# EAGLE design main1 (EAGLE 7.5.0)
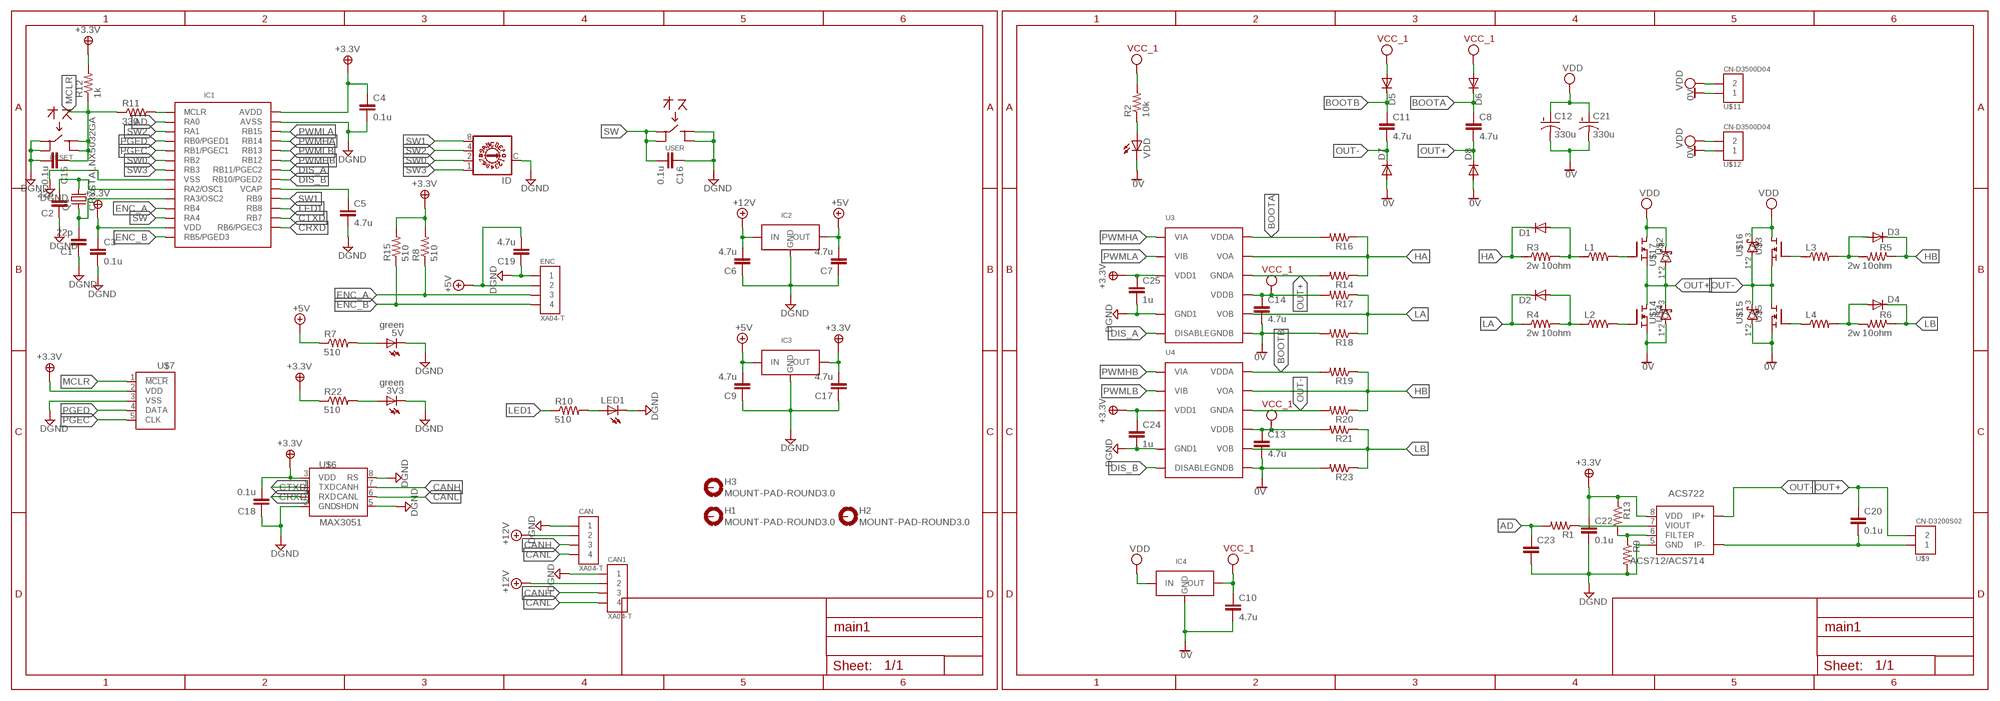
[diagram p0: schematic, sheet 1]

## Parts
3V3  green  LEDCHIPLED_0603  [CHIPLED_0603]
5V  green  LEDCHIPLED_0603  [CHIPLED_0603]
ACS722  ACS712/ACS714  [SOIC8]
C1  22p  C-EUC0603K  [C0603K]
C2  22p  C-EUC0603K  [C0603K]
C3  0.1u  C-EUC0603K  [C0603K]
C4  0.1u  C-EUC0603K  [C0603K]
C5  4.7u  C-EUC0805K  [C0805K]
C6  4.7u  C-EUC0805K  [C0805K]
C7  4.7u  C-EUC0805K  [C0805K]
C8  4.7u  C-EUC0805K  [C0805K]
C9  4.7u  C-EUC0805K  [C0805K]
C10  4.7u  C-EUC0805K  [C0805K]
C11  4.7u  C-EUC0805K  [C0805K]
C12  330u  CPOL-USG  [PANASONIC_G]
C13  4.7u  C-EUC0805K  [C0805K]
C14  4.7u  C-EUC0805K  [C0805K]
C15  0.1u  C-EUC0603K  [C0603K]
C16  0.1u  C-EUC0603K  [C0603K]
C17  4.7u  C-EUC0805K  [C0805K]
C18  0.1u  C-EUC0603K  [C0603K]
C19  4.7u  C-EUC0805K  [C0805K]
C20  0.1u  C-EUC0603K  [C0603K]
C21  330u  CPOL-USG  [PANASONIC_G]
C22  0.1u  C-EUC1206  [C1206]
C23  C-EUC0603K  [C0603K]
C24  1u  C-EUC0603K  [C0603K]
C25  1u  C-EUC0603K  [C0603K]
CAN  XA04-T  [XA04]
CAN1  XA04-T  [XA04]
D1  DIODE-SOD123  [SOD123]
D2  DIODE-SOD123  [SOD123]
D3  DIODE-SOD123  [SOD123]
D4  DIODE-SOD123  [SOD123]
D5  DIODE-SOD123  [SOD123]
D6  DIODE-SOD123  [SOD123]
D7  DIODE-SOD123  [SOD123]
D8  DIODE-SOD123  [SOD123]
ENC  XA04-T  [XA04]
H1  MOUNT-PAD-ROUND3.0  [3,0-PAD]
H2  MOUNT-PAD-ROUND3.0  [3,0-PAD]
H3  MOUNT-PAD-ROUND3.0  [3,0-PAD]
IC1  DSPIC33FJ128MC802  [SOIC28]
IC2  REGULATER_MIC39100-5.0WS  REGULATER_MIC39100-3.3WS  [SOT-223]
IC3  REGULATER_AZ1117CR  [SOT89]
IC4  REGULATER_MIC2940A-5.0WU  [TO-263-3]
ID  A1353HEX  [A1353HEX]
L1  R-US_R0805  [R0805]
L2  R-US_R0805  [R0805]
L3  R-US_R0805  [R0805]
L4  R-US_R0805  [R0805]
LED1  LEDCHIPLED_0603  [CHIPLED_0603]
Q1  CRYSTALNX5032GA  [NX5032GA]
R1  R-US_R0603  [R0603]
R2  10k  R-US_R0603  [R0603]
R3  2w 10ohm  R-US_R2512  [R2512]
R4  2w 10ohm  R-US_R2512  [R2512]
R5  2w 10ohm  R-US_R2512  [R2512]
R6  2w 10ohm  R-US_R2512  [R2512]
R7  510  R-US_R0603  [R0603]
R8  510  R-US_R0603  [R0603]
R9  R-US_R0603  [R0603]
R10  510  R-US_R0603  [R0603]
R11  330  R-US_R0603  [R0603]
R12  1k  R-US_R0603  [R0603]
R13  R-US_R0603  [R0603]
R14  R-US_R0603  [R0603]
R15  510  R-US_R0603  [R0603]
R16  R-US_R0603  [R0603]
R17  R-US_R0603  [R0603]
R18  R-US_R0603  [R0603]
R19  R-US_R0603  [R0603]
R20  R-US_R0603  [R0603]
R21  R-US_R0603  [R0603]
R22  510  R-US_R0603  [R0603]
R23  R-US_R0603  [R0603]
RESET  SWITCH_4PALPS  [SKRP]
U3  ADUM3223_SMD  [SOIC16_N]
U4  ADUM3223_SMD  [SOIC16_N]
U$1  CN-D3500D04  [D-3500D04]
U$2  FET_NCH_FDMS86152  [PQFN_8L]
U$3  FET_NCH_FDMS86152  [PQFN_8L]
U$4  FET_NCH_FDMS86152  [PQFN_8L]
U$5  FET_NCH_FDMS86152  [PQFN_8L]
U$6  MAX3051  [SOIC8]
U$7  WRITE_FOR_PICT  [ZH05]
U$9  CN-D3200S02  [D-3200S02-S]
U$14  SCHOTTKY_BARRIER_DIODE_FSV560  [TO-277]
U$15  SCHOTTKY_BARRIER_DIODE_FSV560  [TO-277]
U$16  SCHOTTKY_BARRIER_DIODE_FSV560  [TO-277]
U$17  SCHOTTKY_BARRIER_DIODE_FSV560  [TO-277]
USER  SWITCH_4PALPS  [SKRP]
VDD  LEDCHIPLED_0603  [CHIPLED_0603]

## Nets
0V: C10.2 C12.- C13.2 C14.2 C21.- D7.A D8.A IC4.2(GND) IC4.PAD(GND) R18.2 R23.2 U3.P$9(GNDB) U4.P$9(GNDB) U$1.01A U$1.02A U$4.1(S) U$4.2(S) U$4.3(S) U$5.1(S) U$5.2(S) U$5.3(S) U$14.1(A) U$14.2(A) U$15.1(A) U$15.2(A) VDD.C
3.3V: ACS722.8(VDD) C3.1 C4.1 C17.2 C18.2 C22.1 C24.1 C25.1 IC1.13(VDD) IC1.28(AVDD) IC3.2(OUT) IC3.P(OUT) R8.2 R12.2 R13.1 R15.2 R22.1 U3.P$3(VDD1) U3.P$8(VDD1) U4.P$3(VDD1) U4.P$8(VDD1) U$6.3(VDD) U$7.2(VDD) ; supply symbol labelled +3.3V
+5V: C7.2 C9.2 C19.2 ENC.PIN2 IC2.3(OUT) IC3.3(IN) R7.1
+12V: C6.2 CAN1.PIN2 CAN.PIN2 IC2.1(IN)
AD: C23.1 IC1.2(RA0) R1.2
BOOTA: C8.1 D6.C R16.2 U3.P$16(VDDA)
BOOTB: C11.1 D5.C R19.2 U4.P$16(VDDA)
CANH: CAN1.PIN3 CAN.PIN3 U$6.7(CANH)
CANL: CAN1.PIN4 CAN.PIN4 U$6.6(CANL)
CRXD: IC1.15(RB6/PGEC3) U$6.4(RXD)
CTXD: IC1.16(RB7) U$6.1(TXD)
DGND: 3V3.C 5V.C ACS722.5(GND) C1.1 C2.1 C3.2 C4.2 C5.2 C6.1 C7.1 C9.1 C15.2 C16.1 C17.1 C18.1 C19.1 C22.2 C23.2 C24.2 C25.2 CAN1.PIN1 CAN.PIN1 ENC.PIN1 IC1.8(VSS) IC1.19(VSS) IC1.27(AVSS) IC2.2(GND) IC2.TAB(GND) IC3.1(GND) ID.C LED1.C R9.2 RESET.1 RESET.2 U3.P$4(GND1) U4.P$4(GND1) U$6.2(GND) U$6.5(SHDN) U$6.8(RS) U$7.3(VSS) USER.3 USER.4
DIS_A: IC1.22(RB11/PGEC2) U3.P$5(DISABLE)
DIS_B: IC1.21(RB10/PGED2) U4.P$5(DISABLE)
ENC_A: ENC.PIN3 IC1.11(RB4) R8.1
ENC_B: ENC.PIN4 IC1.14(RB5/PGED3) R15.1
HA: D1.C R3.1 R14.1 R16.1 U3.P$15(VOA)
HB: D3.C R5.1 R19.1 R20.1 U4.P$15(VOA)
LA: D2.C R4.1 R17.1 R18.1 U3.P$10(VOB)
LB: D4.C R6.1 R21.1 R23.1 U4.P$10(VOB)
LED1: IC1.17(RB8) R10.1
MCLR: C15.1 R11.1 R12.1 RESET.3 RESET.4 U$7.1(!MCLR)
N$1: C2.2 IC1.9(RA2/OSC1) Q1.2
N$2: C1.2 IC1.10(RA3/OSC2) Q1.1
N$3: C5.1 IC1.20(VCAP)
N$4: L2.2 U$4.4(G)
N$5: R2.1 VDD.A
N$6: ACS722.7(VIOUT) R1.1
N$7: LED1.A R10.2
N$8: D1.A L1.1 R3.2
N$9: D2.A L2.1 R4.2
N$10: 5V.A R7.2
N$12: L4.1 U$5.4(G)
N$13: D4.A L4.2 R6.2
N$14: L3.1 U$3.4(G)
N$15: D3.A L3.2 R5.2
N$16: ACS722.3(IP-) ACS722.4(IP-) C20.2 U$9.1 U$9.P$1
N$17: IC1.1(MCLR) R11.2
N$18: ACS722.6(FILTER) R9.1 R13.2
N$22: 3V3.A R22.2
N$23: L1.2 U$2.4(G)
OUT+: C8.2 C20.1 D8.C R14.2 U3.P$14(GNDA) U$2.1(S) U$2.2(S) U$2.3(S) U$4.5(D) U$4.6(D) U$4.7(D) U$4.8(D) U$4.PAD(D) U$9.2 U$9.P$2 U$14.3(C) U$17.1(A) U$17.2(A)
OUT-: ACS722.1(IP+) ACS722.2(IP+) C11.2 D7.C R20.2 U4.P$14(GNDA) U$3.1(S) U$3.2(S) U$3.3(S) U$5.5(D) U$5.6(D) U$5.7(D) U$5.8(D) U$5.PAD(D) U$15.3(C) U$16.1(A) U$16.2(A)
PGEC: IC1.5(RB1/PGEC1) U$7.5(CLK)
PGED: IC1.4(RB0/PGED1) U$7.4(DATA)
PWMHA: IC1.25(RB14) U3.P$1(VIA)
PWMHB: IC1.23(RB12) U4.P$1(VIA)
PWMLA: IC1.26(RB15) U3.P$2(VIB)
PWMLB: IC1.24(RB13) U4.P$2(VIB)
SW: C16.2 IC1.12(RA4) USER.1 USER.2
SW0: IC1.6(RB2) ID.2
SW1: IC1.18(RB9) ID.8
SW2: IC1.3(RA1) ID.4
SW3: IC1.7(RB3) ID.1
VCC_1: C10.1 C13.1 C14.1 D5.A D6.A IC4.3(OUT) R2.2 R17.2 R21.2 U3.P$11(VDDB) U4.P$11(VDDB)
VDD: C12.+ C21.+ IC4.1(IN) U$1.01B U$1.02B U$2.5(D) U$2.6(D) U$2.7(D) U$2.8(D) U$2.PAD(D) U$3.5(D) U$3.6(D) U$3.7(D) U$3.8(D) U$3.PAD(D) U$16.3(C) U$17.3(C)
Unconnected: H1.B3,0(MOUNT) H2.B3,0(MOUNT) H3.B3,0(MOUNT)

## Library data of the parts
3V3 5V LED1 VDD = led:LED: LED OSRAM: - CHIPLED LG R971, LG N971, LY N971, LG Q971, LY Q971, LO R971, LY R971 LH N974, LH R974 LS Q976, LO Q976, LY Q976 LO Q996 - Hyper CHIPLED LW Q18S LB Q993, LB Q99A, LB R99A - SideLED LS A670, LO A670, LY A670, LG A670, LP A670 LB A673, LV A673, LT A673, LW A673 LH A674 LY A675 LS A676, LA A676, LO A676, LY A676, LW A676 LS A679, LY A679, LG A679 - Hyper Micro SIDELED® LS Y876, LA Y876, LO Y876, LY Y876 LT Y87S - SmartLED LW L88C, LW L88S LB L89C, LB L89S, LG L890 LS L89K, LO L89K, LY L89K LS L896, LA L896, LO L896, LY L896 - TOPLED LS T670, LO T670, LY T670, LG T670, LP T670 LSG T670, LSP T670, LSY T670, LOP T670, LYG T670 LG T671, LOG T671, LSG T671 LB T673, LV T673, LT T673, LW T673 LH T674 LS T676, LA T676, LO T676, LY T676, LB T676, LH T676, LSB T676, LW T676 LB T67C, LV T67C, LT T67C, LS T67K, LO T67K, LY T67K, LW E67C LS E67B, LA E67B, LO E67B, LY E67B, LB E67C, LV E67C, LT E67C LW T67C LS T679, LY T679, LG T679 LS T770, LO T770, LY T770, LG T770, LP T770 LB T773, LV T773, LT T773, LW T773 LH T774 LS E675, LA E675, LY E675, LS T675 LS T776, LA T776, LO T776, LY T776, LB T776 LHGB T686 LT T68C, LB T68C - Hyper Mini TOPLED® LB M676 - Mini TOPLED Santana® LG M470 LS M47K, LO M47K, LY M47K Source: http://www.osram.convergy.de LUXEON: - LUMILED® LXK2-PW12-R00, LXK2-PW12-S00, LXK2-PW14-U00, LXK2-PW14-V00 LXK2-PM12-R00, LXK2-PM12-S00, LXK2-PM14-U00 LXK2-PE12-Q00, LXK2-PE12-R00, LXK2-PE12-S00, LXK2-PE14-T00, LXK2-PE14-U00 LXK2-PB12-K00, LXK2-PB12-L00, LXK2-PB12-M00, LXK2-PB14-N00, LXK2-PB14-P00, LXK2-PB14-Q00 LXK2-PR12-L00, LXK2-PR12-M00, LXK2-PR14-Q00, LXK2-PR14-R00 LXK2-PD12-Q00, LXK2-PD12-R00, LXK2-PD12-S00 LXK2-PH12-R00, LXK2-PH12-S00 LXK2-PL12-P00, LXK2-PL12-Q00, LXK2-PL12-R00 Source: www.luxeon.com KINGBRIGHT: KA-3528ASYC Source: www.kingbright.com
ACS722 = Shohei:ACS712/ACS714
C1-C11 C13-C20 C22-C25 = rp_c:C-EU: CAPACITOR, European symbol
C12 C21 = rcl:CPOL-US: POLARIZED CAPACITOR, American symbol
CAN CAN1 ENC = rp_cn_xa:XA04
D1-D8 = diode:DIODE-: DIODE
H1-H3 = Shohei:MOUNT-PAD-ROUND: MOUNTING PAD, round
IC1 = Syohei:DSPIC33FJ128MC802
IC2-IC4 = Shohei:REGULATER
ID = switch-dil:A1353HEX: DIL/CODE SWITCH; OC_FARNELL: unknown; OC_NEWARK: unknown
L1-L4 R1-R23 = rp_r:R-US_: RESISTOR, American symbol
Q1 = Shohei:CRYSTAL
RESET USER = Syohei:SWITCH_4P
U3 U4 = Shohei:ADUM3223
U$1 = Syohei:CN-D3500D04
U$2-U$5 = Shohei:FET_NCH
U$6 = Syohei:MAX3051
U$7 = Syohei:WRITE_FOR_PIC
U$9 = Syohei:CN-D3200S02
U$14-U$17 = Shohei:SCHOTTKY_BARRIER_DIODE

## Board
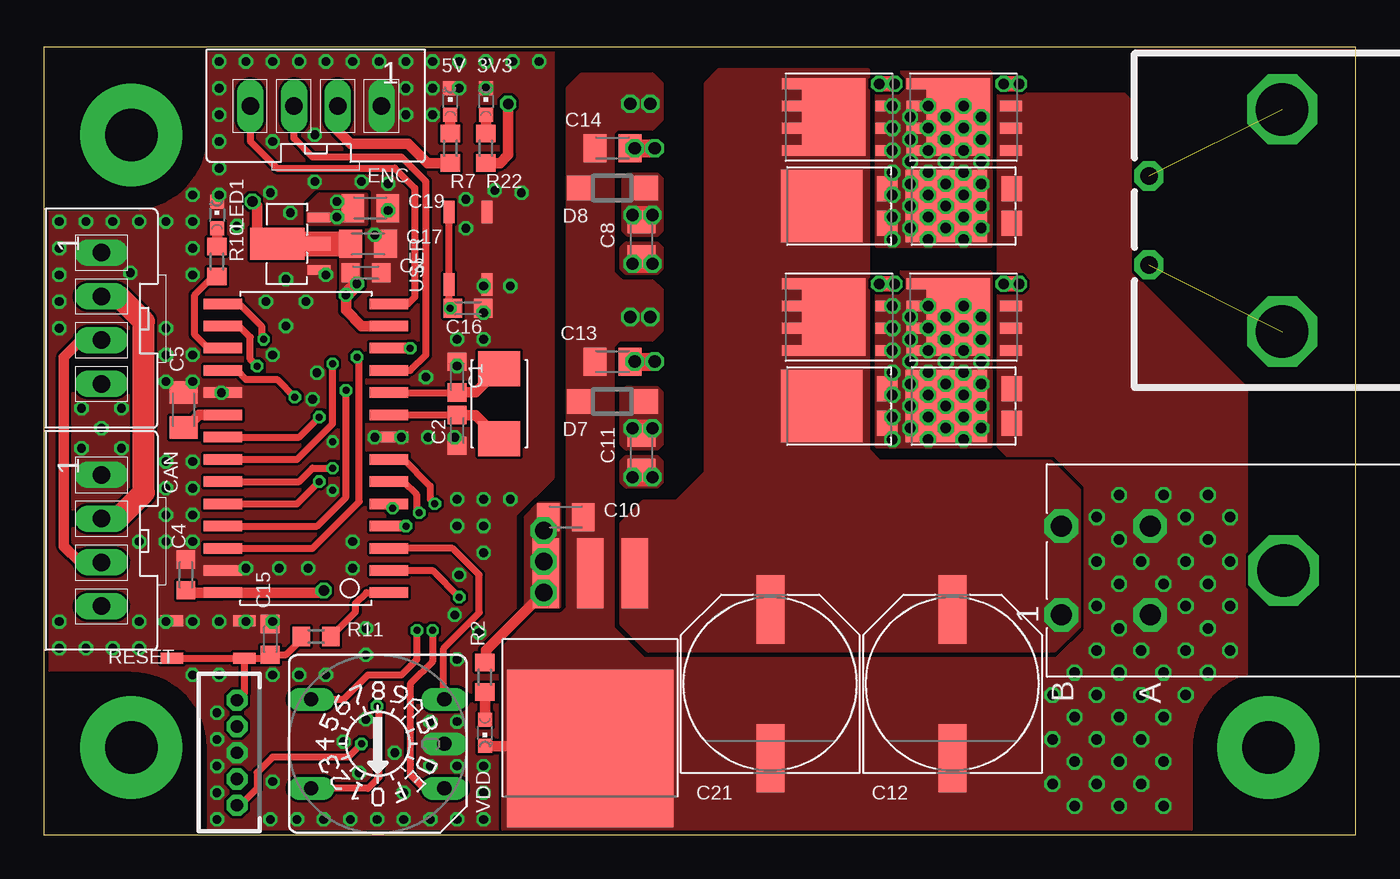
[diagram p1: board, top side]
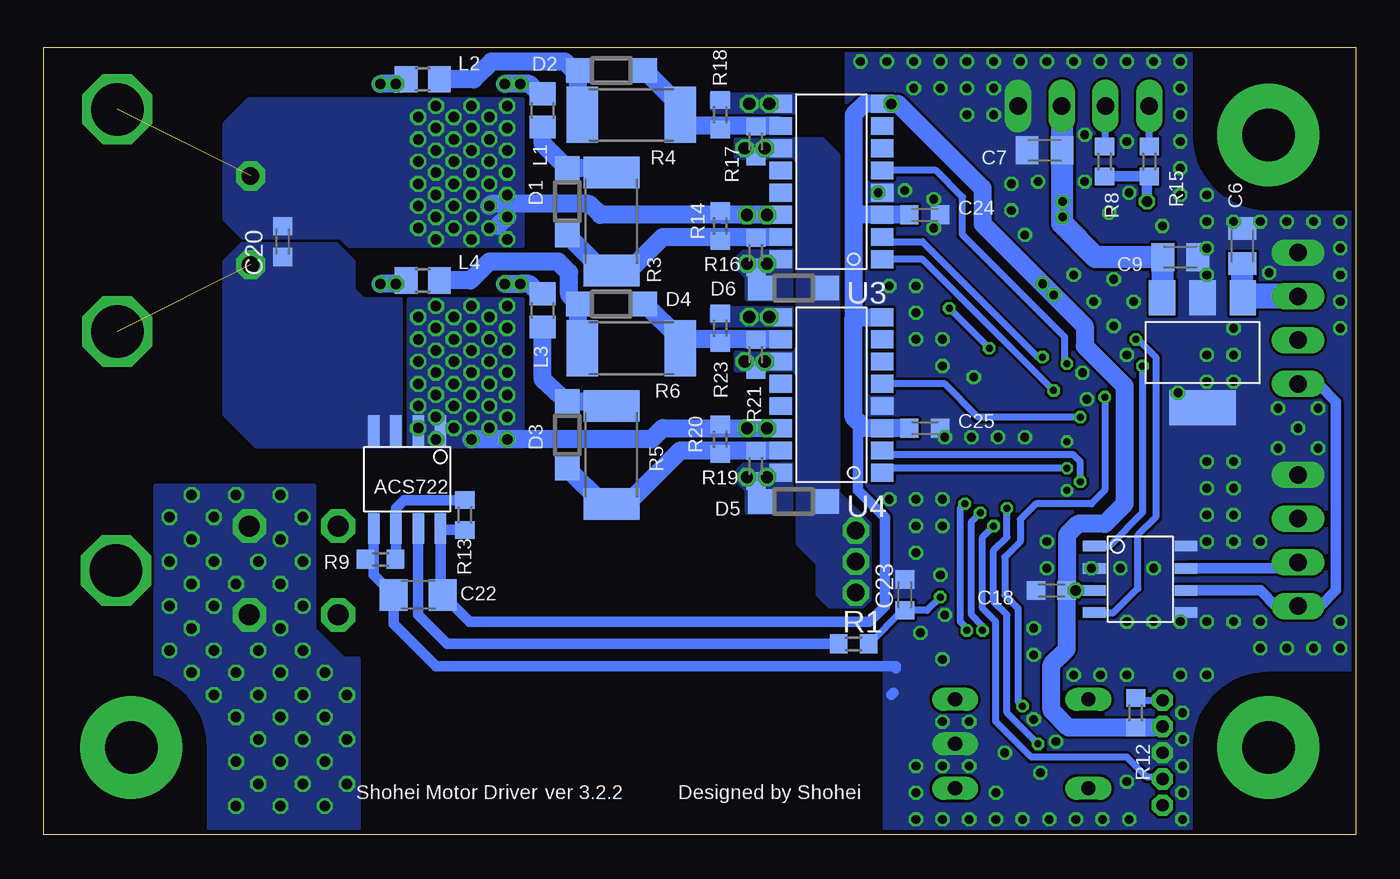
[diagram p2: board, bottom side, seen from below]

Size 75 x 45 mm. Coordinates in mm from the lower left corner, seen from the top.
Outline: 0,0 75,0 75,45 0,45 0,0
Copper layers (1*16): Top 0.035mm / dielectric 1.5mm / Bottom 0.035mm
Design rules "Elecrow_2-layer_eagle_rule": minimum track width 6mil, minimum drill 12mil, track to track 6mil, track to pad 6mil, pad to pad 6mil, via to via 6mil, smd to smd 0mil, copper to edge 10mil, drill to drill 10mil, minimum pad ring 10mil, minimum via ring 6mil, stop-mask expansion 2mil, vias tented up to drill 100mil, thermal gap 10mil
tRestrict: 5 lines

### Footprints (pad centres in the part's own frame; a part is rotated, then mirrored left to right if it is on the bottom)
CHIPLED_0603 = smd 0.8 x 0.8: A 0,-0.75; C 0,0.75
SOIC8 = smd 0.65 x 1.75: 1 -1.905,-2.8; 2 -0.635,-2.8; 3 0.635,-2.8; 4 1.905,-2.8; 5 1.905,2.8; 6 0.635,2.8; 7 -0.635,2.8; 8 -1.905,2.8
C0603K = smd 1.05 x 1.08: 1 -0.875,0; 2 0.875,0
C0805K = smd 1.3 x 1.6: 1 -1,0; 2 1,0
PANASONIC_G = smd 3.9 x 1.6: + 4.25,0; - -4.25,0
C1206 = smd 1.6 x 1.8: 1 -1.4,0; 2 1.4,0
XA04 = drill 1 long: PIN1 0,0; PIN2 -2.5,0; PIN3 -5,0; PIN4 -7.5,0
SOD123 = smd 1.4 x 1.4: A 1.9,0; C -1.9,0
3,0-PAD = drill 3 pad 5.842: B3,0 0,0
SOIC28 = smd 0.6 x 2.2: 1 -8.255,-4.75; 2 -6.985,-4.75; 3 -5.715,-4.75; 4 -4.445,-4.75; 5 -3.175,-4.75; 6 -1.905,-4.75; 7 -0.635,-4.75; 8 0.635,-4.75; 9 1.905,-4.75; 10 3.175,-4.75; 11 4.445,-4.75; 12 5.715,-4.75; 13 6.985,-4.75; 14 8.255,-4.75; 15 8.255,4.75; 16 6.985,4.75; 17 5.715,4.75; 18 4.445,4.75; 19 3.175,4.75; 20 1.905,4.75; 21 0.635,4.75; 22 -0.635,4.75; 23 -1.905,4.75; 24 -3.175,4.75; 25 -4.445,4.75; 26 -5.715,4.75; 27 -6.985,4.75; 28 -8.255,4.75
SOT-223 = smd 1.499 x 2.007: 1 -2.311,-3.15; 2 0,-3.15; 3 2.311,-3.15 | smd 3.81 x 2.007: TAB 0,3.15
SOT89 = smd 0.55 x 1.3: 1 -1.5,0; 3 1.5,0 | smd 0.8 x 1.475: 2 0,0.087 | smd 1.85 x 3.125: P 0,2.388
TO-263-3 = smd 1.5 x 4: 1 -2.54,0; 2 0,0; 3 2.54,0 | smd 9.5 x 9: PAD 0,10
A1353HEX = drill 0.813 long: 1 3.81,-2.54; 2 -3.81,2.54; 4 3.81,2.54; 8 -3.81,-2.54; C 3.81,0
R0805 = smd 1.3 x 1.5: 1 -0.95,0; 2 0.95,0
NX5032GA = smd 2 x 2.4: 1 -2,0; 2 2,0
R0603 = smd 1 x 1.1: 1 -0.85,0; 2 0.85,0
R2512 = smd 1.8 x 3.2: 1 -2.8,0; 2 2.8,0
SKRP = smd 1.27 x 0.635: 1 -2.075,1.075; 2 2.075,1.075; 3 -2.075,-1.075; 4 2.075,-1.075
SOIC16_N = smd 1.016 x 1.27: P$1 -4.445,-2.9; P$2 -3.175,-2.9; P$3 -1.905,-2.9; P$4 -0.635,-2.9; P$5 0.635,-2.9; P$6 1.905,-2.9; P$7 3.175,-2.9; P$8 4.445,-2.9; P$9 4.445,2.9; P$10 3.175,2.9; P$11 1.905,2.9; P$12 0.635,2.9; P$13 -0.635,2.9; P$14 -1.905,2.9; P$15 -3.175,2.9; P$16 -4.445,2.9
D-3500D04 = drill 1.2 pad 1.93 octagon: 01A -2.54,-5.08; 01B -2.54,0; 02A 2.54,-5.08; 02B 2.54,0 | drill 3 pad 4 octagon: P$1 0,-12.7
PQFN_8L = smd 0.61 x 1.27: 1 -1.905,-2.703; 2 -0.635,-2.703; 3 0.635,-2.703; 4 1.905,-2.703 | smd 0.61 x 1.14: 5 1.905,2.703; 6 0.635,2.703; 7 -0.635,2.703; 8 -1.905,2.703 | smd 4.42 x 3.65: PAD 0,0.307
SOIC8' = smd 0.6 x 1.3: 1 -1.905,-2.625; 2 -0.635,-2.625; 3 0.635,-2.625; 4 1.905,-2.625; 5 1.905,2.625; 6 0.635,2.625; 7 -0.635,2.625; 8 -1.905,2.625
ZH05 = drill 0.7 octagon: 1 3,0; 2 1.5,0; 3 0,0; 4 -1.5,0; 5 -3,0
D-3200S02-S = drill 1 pad 1.676 octagon: 1 -2.6,21.28; 2 2.48,21.28 | drill 3 pad 4 octagon: P$1 -6.41,13.66; P$2 6.29,13.66
TO-277 = smd 1.15 x 1.45: 1 2.75,0.985; 2 2.75,-0.985 | smd 4.65 x 4.15: 3 -1,0

### Placement (x,y rotation side)
3V3  25.27,41.91 0 top
5V  23.24,41.91 0 top
ACS722  54.23,20.32 180 bottom
C1  23.62,26.16 270 top
C2  23.62,23.11 90 top
C3  18.41,32.13 0 top
C4  8.13,14.86 90 top
C5  8,24.29 90 top
C6  6.48,33.66 270 bottom
C7  17.78,39.12 0 bottom
C8  34.16,34.04 90 top
C9  10.03,33.02 180 bottom
C10  29.84,18.16 0 top
C11  34.16,21.84 90 top
C12  51.94,8.64 90 top
C13  32.51,27.05 180 top
C14  32.51,39.24 180 top
C15  12.95,11.18 90 top
C16  24.26,30.1 180 top
C17  18.54,33.78 180 top
C18  17.4,13.97 0 bottom
C19  18.67,35.81 180 top
C20  61.34,33.91 270 bottom
C21  41.53,8.64 90 top
C22  53.59,13.72 180 bottom
C23  25.78,13.72 90 bottom
C24  24.64,35.43 0 bottom
C25  24.64,23.24 0 bottom
CAN  3.3,20.57 90 top
CAN1  3.3,33.27 90 top
D1  45.09,36.2 90 bottom
D2  42.55,43.69 180 bottom
D3  45.09,22.86 90 bottom
D4  42.55,30.35 180 bottom
D5  32.13,19.05 0 bottom
D6  32.13,31.24 0 bottom
D7  32.51,24.77 180 top
D8  32.51,36.96 180 top
ENC  19.3,41.66 0 top
H1  5,40 0 top
H2  5,5 0 top
H3  70,5 0 top
IC1  14.99,22.1 90 top
IC2  8.76,27.56 180 bottom
IC3  15.75,33.78 90 top
IC4  31.24,14.95 180 top
ID  19.1,5.21 0 top
L1  46.48,41.4 90 bottom
L2  53.34,43.18 180 bottom
L3  46.48,29.97 270 bottom
L4  53.34,31.69 0 bottom
LED1  9.91,35.43 0 top
Q1  26.04,24.64 270 top
R1  28.7,10.92 0 bottom
R2  25.22,9.02 90 top
R3  42.55,35.05 90 bottom
R4  41.4,41.15 180 bottom
R5  42.55,21.72 90 bottom
R6  41.4,27.81 180 bottom
R7  23.24,39.24 90 top
R8  14.35,38.48 270 bottom
R9  55.75,15.75 180 bottom
R10  9.91,32.77 90 top
R11  15.57,11.34 0 top
R12  12.57,6.99 270 bottom
R13  50.93,18.29 90 bottom
R14  36.32,34.8 90 bottom
R15  11.8,38.48 270 bottom
R16  34.29,33.27 270 bottom
R17  34.29,39.62 270 bottom
R18  36.32,41.15 90 bottom
R19  34.29,21.08 270 bottom
R20  36.32,22.61 90 bottom
R21  34.29,27.43 270 bottom
R22  25.27,39.24 90 top
R23  36.32,28.96 90 bottom
RESET  9.4,11.18 0 top
U3  29.97,37.34 90 bottom
U4  29.97,25.15 90 bottom
U$1  58.17,15.11 90 top
U$2  45.47,41.02 90 top
U$3  45.47,29.59 90 top
U$4  52.58,41.02 90 top
U$5  52.58,29.59 90 top
U$6  MAX3051  [SOIC8']  12.32,14.61 270 bottom
U$7  11.05,4.7 90 top
U$9  84.45,35.18 90 top
U$14  52.58,35.94 0 top
U$15  52.58,24.51 0 top
U$16  45.47,24.51 0 top
U$17  45.47,35.94 0 top
USER  24.26,33.53 90 top
VDD  25.22,5.84 180 top

### Tracks (layer width: path | path; a pad name or v marks a point on that pad's centre or on a via)
0V  (via drill 0.6, 0.7)
  Top 0.61: VDD.C 25.23,5.08 27.05,5.08
  other vias: 34.67,29.59 33.53,29.59 34.67,41.78 33.53,41.78 61.47,19.43 64.01,19.43 66.55,19.43 61.47,16.89 66.55,16.89 60.2,15.62 62.74,15.62 65.28,15.62 67.82,15.62 60.2,18.16 65.28,18.16 67.82,18.16 61.47,14.35 64.01,14.35 66.55,14.35 60.2,13.08 65.28,13.08 67.82,13.08 61.47,11.81 66.55,11.81 60.2,10.54 62.74,10.54 65.28,10.54 67.82,10.54 61.47,9.27 64.01,9.27 66.55,9.27 60.2,8 62.74,8 65.28,8 61.47,6.73 64.01,6.73 57.66,5.46 60.2,5.46 62.74,5.46 58.93,4.19 61.47,4.19 64.01,4.19 57.66,2.92 60.2,2.92 62.74,2.92 58.93,1.65 61.47,1.65 64.01,1.65 57.66,8 58.93,9.27 58.93,6.73
  pour Top (rank 5, no thermals): 26.29,10.03 26.29,0 75.06,0 75.06,45.09 54.61,45.21 54.61,22.23 59.56,17.27 59.56,11.68 57.91,10.03
  pour Bottom (rank 3, no thermals): 32.13,30.1 36.83,30.1 36.83,29.34 36.58,29.08 32.13,29.08
  pour Bottom (rank 3, no thermals): 32.13,42.29 36.83,42.29 36.83,41.53 36.58,41.27 32.13,41.27
  pour Top (rank 3, no thermals): 29.97,9.4 29.97,42.67 30.73,43.43 34.8,43.43 35.31,42.93 35.31,40.89 34.8,40.39 32.77,40.39 32.51,40.13 32.51,32.13 33.02,31.62 34.8,31.62 35.31,31.11 35.31,28.83 34.8,28.32 32.89,28.32 32.51,27.94 32.51,9.4
  pour Top (rank 4, no thermals): 34.92,9.4 31.5,12.83 30.35,13.34 29.59,12.57 27.69,12.57 26.29,11.18 26.29,9.78 27.18,8.89 35.31,8.89
  pour Bottom (no thermals): 57.02,10.03 57.02,0 68.58,0 68.58,19.94 59.56,19.94 59.56,11.68 57.91,10.03
3.3V  (via drill 0.5, 0.6)
  Top 0.406: 17.54,31.13
  Top 0.61: IC1.13 18.16,29.08 17.27,29.97 v17.27,30.86 | IC3.P 12.83,33.78 12.83,33.91 12.19,34.54 12.19,35.94 v11.94,36.2 | C4.1 8.24,13.84 IC1.28 15.88,13.84 v16,13.97 | R22.1 26.07,38.39 26.54,38.86 v26.54,41.78 | 17.14,33.78 C17.2
  Top 0.8: v17.27,30.86 v17.91,31.5 17.54,31.13
  Top 1.422: IC3.P IC3.2 17.14,33.78
  Bottom 0.61: R8.2 R15.2 11.94,37.62 v11.94,36.2 | C18.2 v16,13.97 U$6.3 | 28.45,23.62 28.45,19.68 26.92,18.16 26.92,13.08 27.81,12.19 50.67,12.19 C22.1 52.32,14.1 ACS722.8 52.2,17.44 R13.1
  Bottom 0.813: 16.51,14.46 C18.2
  Bottom 1.016: C18.2 16.52,10.62 17.4,9.75 17.4,7.11 16.42,6.13 R12.2 11.11,6.13 U$7.2 | 28.7,29.59 28.7,23.88 28.45,23.62 28.07,23.24 U4.P$3 C25.1 | 28.7,29.59 U4.P$8 | 28.7,35.43 U3.P$3 C24.1 | 28.7,35.43 28.7,29.59 | 28.7,35.43 28.7,41.15 28.07,41.78 U3.P$8 v26.54,41.78 26.16,41.78 21.34,36.96 21.34,34.92 v17.27,30.86 15.49,29.08 15.49,27.94 13.21,25.65 13.21,18.92 14.35,17.78 15.88,17.78 16.51,17.14 16.51,14.46
  pour Top (no thermals): 17.02,34.16 17.02,30.99 17.4,30.61 18.03,31.24 18.03,34.29
+5V  (via drill 0.5)
  Top 0.61: R7.1 21.93,38.39 20.83,39.5 17.54,39.5 16.78,40.26 16.78,41.63 ENC.PIN2
  Bottom 0.305: v16.76,35.31 16.78,35.31
  Bottom 1.27: 11.02,30.71 IC2.3 11.03,30.75 C9.2 14.86,33.02 16.78,34.94 16.78,35.31 C7.2 | C7.2 16.78,41.63 ENC.PIN2 | 16.76,39.1 C7.2
  other vias: 16.76,36.2
  pour Top (rank 4, no thermals): 18.41,34.92 15.11,34.92 15.11,35.94 15.75,36.58 18.41,36.58
+12V
  Top 1.27: CAN.PIN2 4.23,18.07 5.71,19.56 5.71,29.35 4.29,30.77 CAN1.PIN2
  Bottom 1.27: IC2.1 6.48,30.73 C6.2
  Bottom 1.422: CAN1.PIN2 6.39,30.77 IC2.1
AD  (via drill 0.4)
  Top 0.406: IC1.2 22.23,15.11 v23.75,13.59
  Bottom 0.406: v23.75,13.59 24.51,12.83 25.65,12.83 | 25.65,12.83 25.91,12.83 27.81,10.92 R1.2 | C23.1 25.65,12.84 25.65,12.83
BOOTA  (via drill 0.7)
  Top 1.016: C8.1 v33.67,32.64 v34.8,32.64
  pour Bottom (rank 2, no thermals): 32.26,33.4 34.92,33.4 35.31,33.02 35.31,32.38 34.8,31.88 34.8,30.61 32.26,30.61
  pour Top (no thermals): 33.27,32.13 33.02,32.38 33.02,33.53 33.27,33.78 35.05,33.78 35.31,33.53 35.31,32.38 35.05,32.13
BOOTB  (via drill 0.7)
  Top 1.016: C11.1 v33.67,20.45 v34.8,20.45
  pour Bottom (rank 2, no thermals): 32.26,21.21 34.92,21.21 35.31,20.83 35.31,20.19 34.8,19.68 34.8,18.41 32.26,18.41
  pour Top (no thermals): 33.27,19.94 33.02,20.19 33.02,21.34 33.27,21.59 35.05,21.59 35.31,21.34 35.31,20.19 35.05,19.94
CANH
  Top 0.61: CAN.PIN3 2.08,15.57 1.14,16.51 1.14,27.3 2.11,28.27 CAN1.PIN3
  Bottom 0.61: CAN.PIN3 3.64,15.24 U$6.7
CANL
  Bottom 0.61: U$6.6 5.46,13.97 4.57,13.08 CAN.PIN4 2.04,13.07 1.14,13.97 1.14,24.77 2.15,25.77 CAN1.PIN4
CRXD  (via drill 0.4)
  Top 0.406: IC1.15 11.18,30.35 12.45,29.08 12.45,28.45 v12.57,28.32
  Bottom 0.406: U$6.4 13.84,12.7 12.45,14.1 12.45,17.14 11.43,18.16 11.43,27.3 12.45,28.32 v12.57,28.32
CTXD  (via drill 0.4)
  Top 0.406: v12.19,26.8 11.81,27.18 11.81,28.45 11.18,29.08 IC1.16
  Bottom 0.406: U$6.1 14.1,16.51 12.19,18.41 v12.19,26.8
DGND  (via drill 0.4, 0.5)
  Bottom 0.61: 26.54,8 26.42,8.13 | 26.29,9.53 26.29,9.65 52.58,9.65 54.99,12.07 C22.2 56.13,14.86 56.13,15.75 | 56.13,15.75 ACS722.5 | R9.2 56.13,15.75
  other vias: 0.89,35.05 2.41,35.05 0.89,33.53 0.89,32 0.89,30.48 0.89,28.96 3.94,35.05 5.46,35.05 6.99,35.05 8.51,35.05 8.51,36.58 10.03,36.58 10.03,38.1 10.03,39.62 10.03,41.15 10.03,42.67 10.03,44.2 11.56,44.2 13.08,44.2 14.61,44.2 16.13,44.2 17.65,44.2 19.18,44.2 20.7,44.2 22.23,44.2 22.23,42.67 20.7,42.67 23.75,44.2 25.27,44.2 26.8,44.2 28.32,44.2 23.75,42.67 25.27,42.67 20.7,41.15 22.23,41.15 8.51,33.53 8.51,32 6.99,28.96 6.99,27.43 8.51,27.43 6.99,25.91 8.51,25.91 6.99,21.34 8.51,21.34 6.99,19.81 8.51,19.81 8.51,18.29 6.99,18.29 6.99,16.76 8.51,16.76 5.46,16.76 5.46,12.19 5.46,10.67 3.94,10.67 2.41,10.67 0.89,10.67 0.89,12.19 6.99,12.19 8.51,12.19 10.03,12.19 11.56,12.19 13.08,12.19 8.51,9.14 10.03,9.14 9.91,0.89 9.91,2.41 9.91,3.94 9.91,5.46 9.91,6.99 13.08,9.14 14.61,9.14 16.13,9.14 13.08,3.05 12.95,0.89 14.48,0.89 16,0.89 17.53,0.89 19.05,0.89 20.57,0.89 22.1,0.89 23.62,0.89 25.15,0.89 25.15,2.41 25.15,3.94 23.62,3.94 22.1,3.94 20.57,2.41 23.62,10.03 25.15,16.13 25.15,17.65 25.15,19.18 23.62,19.18 23.62,17.65 26.67,19.18 17.65,15.24 17.65,16.76 15.11,15.24 11.56,15.24 23.62,26.8 23.62,28.32 25.15,28.32 26.67,31.37 25.15,31.37 25.15,29.84 18.92,34.29 14.99,30.48 12.7,30.48 13.08,27.43 16.13,32 12.95,36.7 13.84,29.08 15.62,26.42 15.37,24.89 10.16,25.27 16.51,22.48 16.51,19.68 13.46,15.24 17.14,5.33 18.41,6.6 18.41,10.29 18.41,11.81 23.5,12.57 23.75,14.86 24.89,11.56 23.62,6.48 22.1,6.48 20.07,4.7 18.03,3.56 4.45,22.1 4.45,24.38 2.16,24.38 2.16,22.1 3.3,23.24 4.95,32.13 24.13,34.67 24.13,36.32 25.78,36.83 27.3,36.7 21.84,26.16 19.68,37.21 19.68,35.69 18.92,22.73 20.45,22.73 21.97,22.73 23.5,22.73 13.08,39.62 15.49,40.01 13.84,31.75 14.1,35.56 15.49,37.34 18.16,37.34 11.05,34.8
  pour Bottom (rank 6, no thermals): 0,0 0,45 29.08,45 29.08,19.56 26.92,17.4 26.92,0
  pour Top (rank 6, no thermals): 0,0 0,45 29.08,45 29.08,20.45 26.92,18.29 26.92,0
DIS_A  (via drill 0.4)
  Top 0.406: IC1.22 14.48,21.46 16.51,23.5 v16.51,26.92
  Bottom 0.406: U3.P$5 24,37.97 22.48,36.45 22.48,34.29 16.64,28.45 16.64,27.05 v16.51,26.92
DIS_B  (via drill 0.4)
  Top 0.406: IC1.21 14.61,22.73 v15.75,23.88
  Bottom 0.406: v15.75,23.88 21.59,23.88 23.5,25.78 U4.P$5
ENC_A
  Top 0.406: IC1.11 20.95,26.54 21.84,27.43 21.84,37.34 20.45,38.73 15.37,38.73 14.3,39.8 ENC.PIN3
  Bottom 0.406: 14.3,39.38 ENC.PIN3
  Bottom 0.61: R8.1 14.3,39.38
ENC_B
  Top 0.406: ENC.PIN4 11.8,39.63 13.34,38.1 20.07,38.1 21.21,36.96 21.21,30.73 20.83,30.35 IC1.14
  Bottom 0.406: R15.1 ENC.PIN4
  Bottom 0.61: R15.1
HA
  Bottom 1.016: U3.P$15 34.29,34.16 | 34.29,34.16 36.32,34.16 | 36.32,34.16 39.62,34.16 41.53,32.25 R3.1 43.04,32.25 D1.C | R14.1 36.32,34.16 | R16.1 34.29,34.16
HB
  Bottom 1.016: D3.C 43.04,18.92 R5.1 41.66,18.92 38.61,21.97 36.32,21.97 | 36.32,21.97 34.29,21.97 | 34.29,21.97 U4.P$15 | R20.1 36.32,21.97 | R19.1 34.29,21.97
LA
  Bottom 1.016: U3.P$10 34.29,40.51 | 34.29,40.51 36.32,40.51 | 36.32,40.51 38.6,40.51 R4.1 38.6,41.65 D2.C | R18.1 36.32,40.51 | R17.1 34.29,40.51
LB
  Bottom 1.016: U4.P$10 34.29,28.32 | 34.29,28.32 36.32,28.32 | 36.32,28.32 38.6,28.32 | 38.6,28.32 R6.1 | R23.1 36.32,28.32 | R21.1 34.29,28.32 | 38.6,28.32 38.61,28.32 D4.C
LED1
  Top 0.406: IC1.17 9.4,27.81 8.64,28.57 8.64,30.86 9.69,31.92 R10.1
MCLR
  Top 0.406: RESET.4 12.88,10.1 C15.1 13.86,10.3 14.72,11.16 | RESET.3 RESET.4 | U$7.1 11.47,8.12 RESET.4
  Top 0.61: 14.72,11.16 R11.1
  Bottom 0.406: 12.44,7.7 U$7.1
  Bottom 0.61: R12.1 12.44,7.7
N$1
  Top 0.406: IC1.9 23.61,24 C2.2
  Top 0.61: 23.48,24 C2.2 24.68,23.99 Q1.2
N$2
  Top 0.406: IC1.10 23.61,25.27
  Top 0.61: 23.61,25.27 C1.2 24.68,25.29 Q1.1
N$3
  Top 0.61: C5.1 8.18,23.29 8.89,24 IC1.20
N$4  (via drill 0.6)
  Top 0.889: v55.75,42.93 U$4.4 v54.86,42.93 v55.75,42.93
  Bottom 1.016: L2.2 54.54,42.93 v54.86,42.93 v55.75,42.93
N$5
  Top 0.61: R2.1 VDD.A
N$6
  Bottom 0.61: R1.1 51.94,10.92 53.59,12.57 ACS722.7
N$7
  Top 0.61: R10.2 LED1.A
N$8
  Bottom 1.016: R3.2 42.55,38.09 D1.A 46.48,39.49 L1.1
N$9
  Bottom 1.016: R4.2 44.45,41.39 D2.A 44.7,43.69 45.21,44.2 49.4,44.2 50.42,43.18 L2.1
N$10
  Top 0.61: R7.2 5V.A
N$11
  cutout Top: 0,0 9.2,0 9.2,5 arc90 5,9.2 0,9.2
  cutout Bottom: 0,0 0,9.2 5,9.2 arc-90 9.2,5 9.2,0
  cutout Bottom: 0,45 9.2,45 9.2,40 arc-90 5,35.8 0,35.8
  cutout Top: 0,45 0,35.8 5,35.8 arc90 9.2,40 9.2,45
  cutout Top: 75,0 75,9.2 70,9.2 arc90 65.8,5 65.8,0
  cutout Bottom: 75,0 65.8,0 65.8,5 arc-90 70,9.2 75,9.2
N$12  (via drill 0.6)
  Top 0.889: v55.75,31.5 U$5.4 v54.86,31.5
  Bottom 1.016: L4.1 54.48,31.5 v55.75,31.5
N$13
  Bottom 1.016: R6.2 44.45,28.06 D4.A 44.96,30.87 44.96,32.13 45.59,32.77 49.53,32.77 50.61,31.69 L4.2
N$14  (via drill 0.6)
  Top 0.889: v48.64,31.5 v47.75,31.5 U$3.4
  Bottom 1.016: v48.64,31.5 v47.75,31.5 47.24,31.5 46.67,30.92 L3.1
N$15
  Bottom 1.016: R5.2 42.79,24.76 D3.A 46.48,26.03 L3.2
N$16  (1 unrouted)
  pour Bottom (rank 2, no thermals): 54.61,22.23 54.61,30.61 56.77,30.61 57.28,31.11 57.28,32.77 58.29,33.78 63.63,33.78 64.64,32.77 64.64,24 62.87,22.23
N$17
  Top 0.406: IC1.1 18.44,13.84 17.83,13.23 17.83,12.75 16.8,11.72 R11.2
N$18
  Bottom 0.61: R13.2 54.4,19.14 54.86,18.67 ACS722.6 54.86,15.84 R9.1
N$22
  Top 0.61: R22.2 3V3.A
N$23  (via drill 0.6)
  Top 0.889: v47.75,42.93 U$2.4 v48.64,42.93
  Bottom 1.016: v48.64,42.93 47.24,42.93 46.67,42.35 L1.2
OUT+  (via drill 0.6, 0.7)  (1 unrouted)
  Top 0.813: C8.2 v33.66,35.43
  Top 1.016: v33.66,35.43 v34.8,35.43
  Bottom 0.305: R14.2 36.32,35.56 36.2,35.43
  Bottom 0.813: v33.66,35.43 U3.P$14
  Bottom 1.016: v33.66,35.43 v34.8,35.43 36.2,35.43 43.18,35.43 43.81,36.07 49.4,36.07 v49.53,35.94 | v48.51,35.31 49.02,34.8
  other vias: 48.51,34.04 48.51,37.85 48.51,39.12 48.51,40.39 48.51,41.66 49.53,34.67 49.53,38.48 49.53,39.75 50.55,35.31 49.53,37.21 50.55,40.39 50.55,37.85 50.55,36.58 50.55,34.04 50.55,39.12 49.53,41.02 50.55,41.66 48.51,36.58 51.56,41.02 51.56,39.75 51.56,38.48 51.56,37.21 51.56,35.94 51.56,34.67 52.58,34.04 52.58,35.31 52.58,36.58 52.58,37.85 52.58,39.12 52.58,40.39 52.58,41.66 53.59,41.02 53.59,39.75 53.59,38.48 53.59,37.21 53.59,35.94 53.59,34.67
  pour Top (no thermals): 47.62,33.66 47.62,43.56 54.1,43.56 54.1,33.66
  pour Bottom (no thermals): 47.62,33.66 57.53,33.66 58.04,34.16 63.63,34.16 64.64,35.18 64.64,40.64 63.25,42.04 47.62,42.04
  pour Top (no thermals): 35.18,34.8 34.92,34.54 33.4,34.54
  pour Top (no thermals): 33.4,34.29 33.15,34.54 33.15,37.47 33.4,37.72 35.05,37.72 35.31,37.47 35.31,34.54 35.05,34.29
OUT-  (via drill 0.6, 0.7)
  Top 0.813: C11.2 v33.66,23.24
  Top 1.016: v33.66,23.24 v34.8,23.24
  Bottom 0.305: R20.2 36.32,23.37 36.45,23.24
  Bottom 0.813: v33.66,23.24 U4.P$14
  Bottom 1.016: v33.66,23.24 v34.8,23.24 36.45,23.24 39.62,23.24 40.26,22.61 v50.55,22.61
  other vias: 48.51,26.42 49.53,23.24 48.51,25.15 48.51,23.88 48.51,22.61 49.53,24.51 48.51,30.23 48.51,28.96 48.51,27.69 49.53,27.05 49.53,28.32 49.53,25.78 53.59,24.51 50.55,23.88 50.55,25.15 52.58,23.88 51.56,24.51 51.56,23.24 52.58,22.61 53.59,23.24 49.53,29.59 51.56,25.78 52.58,25.15 53.59,25.78 50.55,26.42 51.56,27.05 52.58,26.42 53.59,27.05 50.55,27.69 50.55,28.96 50.55,30.23 51.56,28.32 52.58,27.69 53.59,28.32 51.56,29.59 52.58,28.96 53.59,29.59 52.58,30.23
  pour Top (no thermals): 47.62,32.13 54.1,32.13 54.1,22.23 47.62,22.23
  pour Bottom (rank 3, no thermals): 47.62,22.23 47.62,30.61 54.1,30.61 54.1,22.23
  pour Top (no thermals): 33.27,22.1 33.02,22.35 33.02,25.27 33.27,25.53 35.05,25.53 35.31,25.27 35.31,22.35 35.05,22.1
PGEC  (via drill 0.4)
  Top 0.406: v18.16,5.21 17.4,4.45 13.08,4.45 12.19,3.56 12.19,2.67 11.22,1.7 U$7.5 | v19.94,18.67 19.94,18.92 IC1.5
  Bottom 0.406: v18.16,5.21 19.94,6.99 19.94,12.57 20.7,13.34 20.7,16.26 19.94,17.02 v19.94,18.67
PGED  (via drill 0.4)
  Top 0.406: v20.7,17.65 IC1.4
  Bottom 0.406: U$7.4 11.15,3.3 11.94,3.3 13.08,4.45 18.54,4.45 20.57,6.48 20.57,12.19 21.34,12.95 21.34,17.02 v20.7,17.65
PWMHA  (via drill 0.4)
  Top 0.406: IC1.25 15.62,17.65 17.27,19.3 v17.27,25.4
  Bottom 0.406: v17.27,25.4 24.77,32.89 U3.P$1
PWMHB  (via drill 0.4)
  Top 0.406: IC1.23 14.61,20.19 15.37,20.95 v16.51,20.95
  Bottom 0.406: v16.51,20.95 26.82,20.95 U4.P$1
PWMLA  (via drill 0.4)
  Top 0.406: v17.91,27.3 18.03,27.18 18.03,19.05 15.37,16.38 IC1.26
  Bottom 0.406: U3.P$2 26.82,33.91 24.77,33.91 18.16,27.3 v17.91,27.3
PWMLB  (via drill 0.4)
  Top 0.406: IC1.24 14.48,18.92 v15.75,20.19
  Bottom 0.406: v15.75,20.19 15.75,21.34 16.13,21.72 26.82,21.72 U4.P$2
SW  (via drill 0.4)
  Top 0.406: IC1.12 v20.95,27.81 | USER.2 USER.1 23.18,30.3 C16.2
  Top 0.61: v23.24,30.1 23.31,30.17 23.18,30.3
  Bottom 0.406: v20.95,27.81 v23.24,30.1
SW0  (via drill 0.4)
  Top 0.406: IC1.6 20.57,20.19 21.34,19.43 21.34,18.54 v21.46,18.41 | ID.2 17.14,7.75 18.54,9.14 20.45,9.14 21.34,10.03 v21.34,11.68
  Bottom 0.406: v21.34,11.68 21.34,11.94 21.97,12.57 21.97,17.91 v21.46,18.41
SW1  (via drill 0.4)
  Top 0.406: IC1.18 11.05,26.54 11.56,26.04 13.34,26.04 v14.35,25.02 | ID.8 18.54,2.67 19.18,3.3 19.18,7.24 v19.05,7.37
  Bottom 0.406: v14.35,25.02 14.35,19.68 15.11,18.92 18.29,18.92 19.18,18.03 19.18,16.76 20.07,15.88 20.07,13.72 19.3,12.95 19.3,7.62 v19.05,7.37
SW2
  Top 0.406: IC1.3 23.37,16.38 24.89,14.86 24.89,12.7 22.86,10.67 22.86,7.87 22.91,7.79 ID.4
SW3  (via drill 0.4)
  Top 0.406: IC1.7 20.57,21.46 22.1,19.94 22.1,19.18 v22.35,18.92 | v22.23,11.68 22.23,9.91 20.95,8.64 20.95,3.43 21.72,2.67 ID.1
  Bottom 0.406: v22.23,11.68 22.23,11.81 22.61,12.19 22.61,18.67 v22.35,18.92
VCC_1  (via drill 0.7, 1)
  Top 0.61: 28.57,13.78 v28.57,13.84 28.57,13.34 28.07,13.34 25.27,10.54 25.27,9.92 R2.2
  Top 1.016: C13.1 v34.92,27.05 | C14.1 v34.92,39.24
  other vias: 28.57,17.4 28.57,15.62 33.78,39.24 33.78,27.05
  pour Top (rank 2, no thermals): 29.46,18.92 29.46,13.08 27.56,13.08 27.56,18.16 28.32,18.92
  pour Bottom (no thermals): 28.19,13.08 27.81,13.46 27.81,17.78 29.59,19.56 29.59,38.86 30.48,39.75 35.43,39.75 35.43,38.73 32.13,38.73 31.88,38.48 31.88,27.81 32.13,27.56 35.43,27.56 35.43,26.54 32.13,26.54 31.88,26.29 31.88,16.64 30.73,15.49 30.73,13.72 30.1,13.08
VDD
  pour Top (rank 2, no thermals): 57.78,10.54 34.54,10.54 33.02,12.06 33.02,17.78 34.29,19.05 36.2,19.05 37.85,20.7 37.85,42.93 38.61,43.69 47.12,43.69 47.12,21.97 47.75,21.34 57.53,21.34 59.18,19.68 59.18,11.94

### Text on the board
bPlace: Designed by Shohei | ver 3.2.2 | Shohei Motor Driver